# Altium schematic sheet FrontIrArray.SchDoc
size A; SheetNumber: 6; SheetTotal: 11
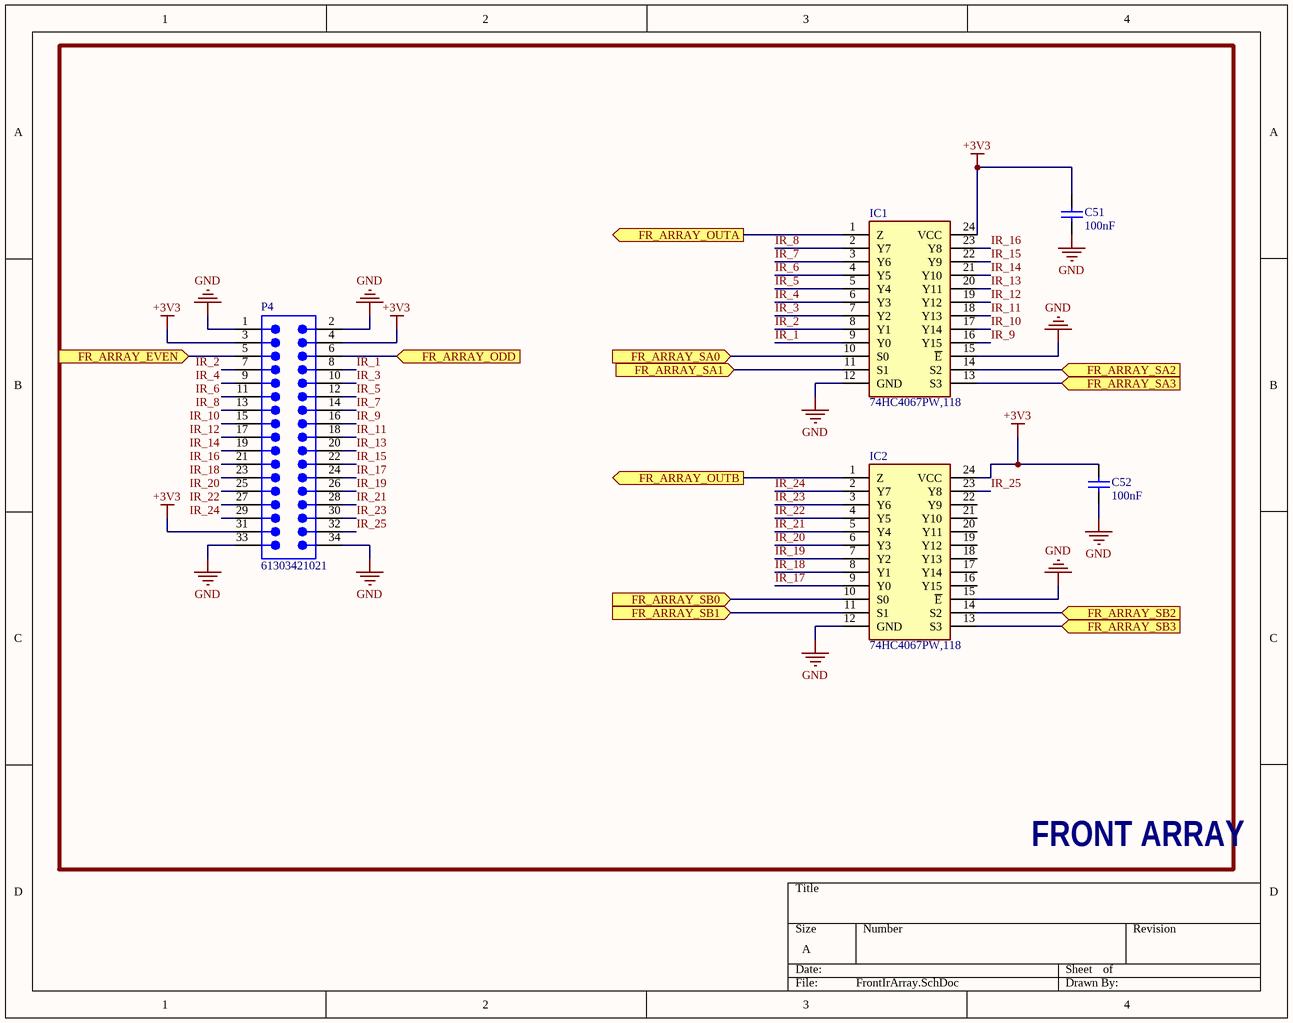
[diagram p0: FrontIrArray.SchDoc]

## Parts
C51  Capacitance: 100nF  [CAPC1050X55X23ML05T13]  (hidden comment: CL05B104KO5NNNC)
C52  Capacitance: 100nF  [CAPC1050X55X23ML05T13]  (hidden comment: CL05B104KO5NNNC)
IC1  74HC4067PW,118  [SOP65P640X110-24N]
IC2  74HC4067PW,118  [SOP65P640X110-24N]
P4  61303421021  [61303421021]

## Blocks framed on the sheet
FRONT ARRAY: C51 C52 IC1 IC2 P4

## Ports
FR_ARRAY_EVEN (in, see Main[4A], MicroController[1C]), FR_ARRAY_ODD (in, see Main[4A], MicroController[1C]), FR_ARRAY_OUTA (out, see Main[3A], MicroController[1C]), FR_ARRAY_OUTB (out, see Main[3A], MicroController[1C]), FR_ARRAY_SA0 (in, see Main[3A], MicroController[2C]), FR_ARRAY_SA1 (in, see Main[3A], MicroController[2C]), FR_ARRAY_SA2 (in, see Main[3A], MicroController[2C]), FR_ARRAY_SA3 (in, see Main[3A], MicroController[2C]), FR_ARRAY_SB0 (in, see Main[3A], MicroController[2C]), FR_ARRAY_SB1 (in, see Main[3A], MicroController[2C]), FR_ARRAY_SB2 (in, see Main[4A], MicroController[2C]), FR_ARRAY_SB3 (in, see Main[4A], MicroController[2C])

## Nets
+3V3: C51.1 C52.1 IC1.24(VCC) IC2.24(VCC) P4.3 P4.4 P4.31
GND: C51.2 C52.2 IC1.12(GND) IC1.15(~{E}) IC2.12(GND) IC2.15(~{E}) P4.1 P4.2 P4.33 P4.34
FR_ARRAY_EVEN: P4.5 ; port FR_ARRAY_EVEN
FR_ARRAY_ODD: P4.6 ; port FR_ARRAY_ODD
FR_ARRAY_OUTA: IC1.1(Z) ; port FR_ARRAY_OUTA
FR_ARRAY_OUTB: IC2.1(Z) ; port FR_ARRAY_OUTB
FR_ARRAY_SA0: IC1.10(S0) ; port FR_ARRAY_SA0
FR_ARRAY_SA1: IC1.11(S1) ; port FR_ARRAY_SA1
FR_ARRAY_SA2: IC1.14(S2) ; port FR_ARRAY_SA2
FR_ARRAY_SA3: IC1.13(S3) ; port FR_ARRAY_SA3
FR_ARRAY_SB0: IC2.10(S0) ; port FR_ARRAY_SB0
FR_ARRAY_SB1: IC2.11(S1) ; port FR_ARRAY_SB1
FR_ARRAY_SB2: IC2.14(S2) ; port FR_ARRAY_SB2
FR_ARRAY_SB3: IC2.13(S3) ; port FR_ARRAY_SB3
IR_1: IC1.9(Y0) P4.8
IR_2: IC1.8(Y1) P4.7
IR_3: IC1.7(Y2) P4.10
IR_4: IC1.6(Y3) P4.9
IR_5: IC1.5(Y4) P4.12
IR_6: IC1.4(Y5) P4.11
IR_7: IC1.3(Y6) P4.14
IR_8: IC1.2(Y7) P4.13
IR_9: IC1.16(Y15) P4.16
IR_10: IC1.17(Y14) P4.15
IR_11: IC1.18(Y13) P4.18
IR_12: IC1.19(Y12) P4.17
IR_13: IC1.20(Y11) P4.20
IR_14: IC1.21(Y10) P4.19
IR_15: IC1.22(Y9) P4.22
IR_16: IC1.23(Y8) P4.21
IR_17: IC2.9(Y0) P4.24
IR_18: IC2.8(Y1) P4.23
IR_19: IC2.7(Y2) P4.26
IR_20: IC2.6(Y3) P4.25
IR_21: IC2.5(Y4) P4.28
IR_22: IC2.4(Y5) P4.27
IR_23: IC2.3(Y6) P4.30
IR_24: IC2.2(Y7) P4.29
IR_25: IC2.23(Y8) P4.32

Not connected (* = marked no-connect by the designer): IC2 16(Y15) 17(Y14) 18(Y13) 19(Y12) 20(Y11) 21(Y10) 22(Y9)

## Library data of the parts
C51 C52 = CMP-2000-05439-1: Chip Capacitor, 100 nF, +/- 10%, 16 V, -55 to 125 degC, 0402 (1005 Metric), RoHS, Tape and Reel; Manufacturer: Samsung Electro-Mechanics; Dielectric: X7R; Rated Voltage: 16V; Case Size/Dimension: 0402; Tolerance (%): ±10%; Manufacturer URL: http://www.samsungsem.com/global/index.jsp; Datasheet URL: https://datasheet.ciiva.com/29198/458718-da-01-en-vs-kondensator-0402-29198423.pdf; Datasheet Version: Nov-10
IC1 IC2 = 74HC4067PW,118: Integrated Circuit; Manufacturer_Name: Nexperia; Datasheet Link: https://assets.nexperia.com/documents/data-sheet/74HC_HCT4067.pdf; Height: 1.1mm; Manufacturer_Part_Number: 74HC4067PW,118; Mouser Part Number: 771-74HC4067PW-T; Mouser Price/Stock: https://www.mouser.co.uk/ProductDetail/Nexperia/74HC4067PW118?qs=P62ublwmbi9BArRi%252BuDUjA%3D%3D; Arrow Part Number: 74HC4067PW,118; Arrow Price/Stock: https://www.arrow.com/en/products/74hc4067pw118/nexperia?region=nac
P4 = CMP-1502-01126-2: NexarPartId: 32855571; Pitch: 2.54mm; Current Rating: 3A; Gender: Male; Number of Positions: 34; Contact Resistance: 20mΩ; Connector Type: Male Pin; Voltage Rating: 250V; Contact Mating Length: 5.9944mm; Height: 5.23mm; Row Spacing: 2.54mm; REACH SVHC: Unknown; Number of Pins: 34; Contact Plating: Gold; Termination: Solder; Number of Contacts: 34; Contact Material: Copper; Packaging: Bulk; Lead Pitch: 2.54mm; Min Operating Temperature: -40°C; Max Operating Temperature: 105°C; Number of Rows: 2; Color: Black; RoHS: Compliant; Mount: Through Hole; Operating Supply Voltage: 250V